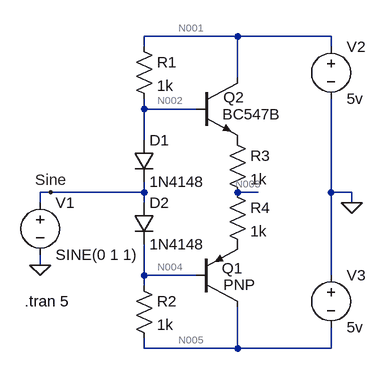
[diagram p0: schematic Class AB Amplifier.asc]
Class AB Amplifier.asc, the LTspice schematic file:
Version 4
SHEET 1 880 680
WIRE 336 -96 192 -96
WIRE 480 -96 336 -96
WIRE 192 -80 192 -96
WIRE 480 -80 480 -96
WIRE 336 -32 336 -96
WIRE 192 16 192 0
WIRE 272 16 192 16
WIRE 192 64 192 16
WIRE 48 144 32 144
WIRE 192 144 192 128
WIRE 192 144 48 144
WIRE 368 144 336 144
WIRE 480 144 480 0
WIRE 512 144 480 144
WIRE 32 160 32 144
WIRE 192 160 192 144
WIRE 512 160 512 144
WIRE 32 256 32 240
WIRE 192 272 192 224
WIRE 272 272 192 272
WIRE 480 272 480 144
WIRE 192 288 192 272
WIRE 192 384 192 368
WIRE 336 384 336 320
WIRE 336 384 192 384
WIRE 480 384 480 352
WIRE 480 384 336 384
FLAG 32 256 0
FLAG 48 144 Sine
FLAG 512 160 0
SYMBOL voltage 32 144 R0
WINDOW 123 0 0 Left 2
WINDOW 39 0 0 Left 2
SYMATTR InstName V1
SYMATTR Value SINE(0 1 1)
SYMBOL diode 176 64 R0
SYMATTR InstName D1
SYMATTR Value 1N4148
SYMBOL diode 176 160 R0
SYMATTR InstName D2
SYMATTR Value 1N4148
SYMBOL res 176 -96 R0
SYMATTR InstName R1
SYMATTR Value 1k
SYMBOL res 176 272 R0
SYMATTR InstName R2
SYMATTR Value 1k
SYMBOL voltage 480 -96 R0
WINDOW 123 0 0 Left 2
WINDOW 39 0 0 Left 2
SYMATTR InstName V2
SYMATTR Value 5v
SYMBOL voltage 480 256 R0
WINDOW 123 0 0 Left 2
WINDOW 39 0 0 Left 2
SYMATTR InstName V3
SYMATTR Value 5v
SYMBOL pnp 272 320 M180
WINDOW 0 40 59 Left 2
WINDOW 3 42 34 Left 2
SYMATTR InstName Q1
SYMBOL npn 272 -32 R0
WINDOW 0 42 30 Left 2
WINDOW 3 41 56 Left 2
SYMATTR InstName Q2
SYMATTR Value BC547B
SYMBOL res 320 48 R0
SYMATTR InstName R3
SYMATTR Value 1k
SYMBOL res 320 128 R0
SYMATTR InstName R4
SYMATTR Value 1k
TEXT 8 312 Left 2 !.tran 5

The netlist it stands for:
* Class AB Amplifier.asc
V1 Sine 0 SINE(0 1 1)
D1 N002 Sine 1N4148
D2 Sine N004 1N4148
R1 N001 N002 1k
R2 N004 N005 1k
V2 N001 0 5v
V3 0 N005 5v
Q1 N005 N004 P001 0 PNP
Q2 N001 N002 P002 0 BC547B
R3 P002 N003 1k
R4 N003 P001 1k
.model D D
.lib standard.dio
.model NPN NPN
.model PNP PNP
.lib standard.bjt
.tran 5
.backanno
.end

* Results of the author's LTspice run, read from the files saved beside the schematic
* Operating Point, zero values left out:
*   V(n002) = 653.2 mV
*   V(n004) = -653.2 mV
*   V(n001) = 5 V
*   V(n005) = -5 V
*   V(p001) = 34.09 mV
*   V(p002) = 104.2 mV
*   V(n003) = 69.15 mV
*   Ic(Q2) = 34.95 µA
*   Ib(Q2) = 116.8 nA
*   Ie(Q2) = -35.06 µA
*   Ic(Q1) = -34.72 µA
*   Ib(Q1) = -347.2 nA
*   Ie(Q1) = 35.06 µA
*   I(D2) = 4.346 mA
*   I(D1) = 4.347 mA
*   I(R4) = 35.06 µA
*   I(R3) = 35.06 µA
*   I(R2) = 4.347 mA
*   I(R1) = 4.347 mA
*   I(V3) = -4.381 mA
*   I(V2) = -4.382 mA
*   I(V1) = 227.9 nA
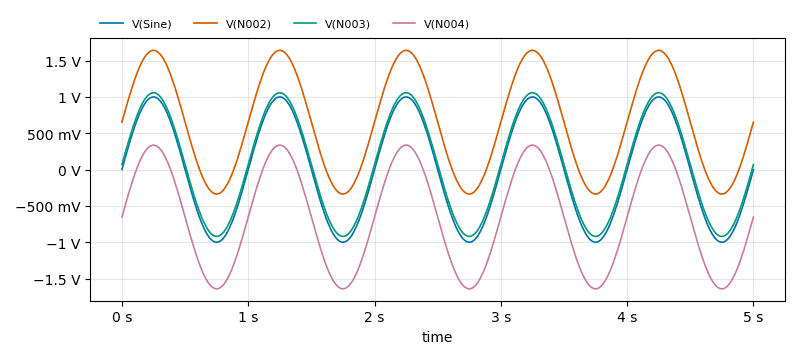
[diagram p1: Transient Analysis of Class AB Amplifier.asc, plotted from the saved traces]
* Transient Analysis, 1 run:
*   V(Sine): min -999.6 mV, max 999.6 mV, average -56.81 µV, rms 707.3 mV, last 0 V
*   V(N002): min -336.6 mV, max 1.641 V, average 652.6 mV, rms 956.7 mV, last 653.2 mV
*   V(N003): min -919.2 mV, max 1.058 V, average 69.1 mV, rms 702.8 mV, last 69.15 mV
*   V(N004): min -1.641 V, max 336.6 mV, average -652.7 mV, rms 956.7 mV, last -653.2 mV